# EAGLE design FET_1_0 (EAGLE 7.6.0)
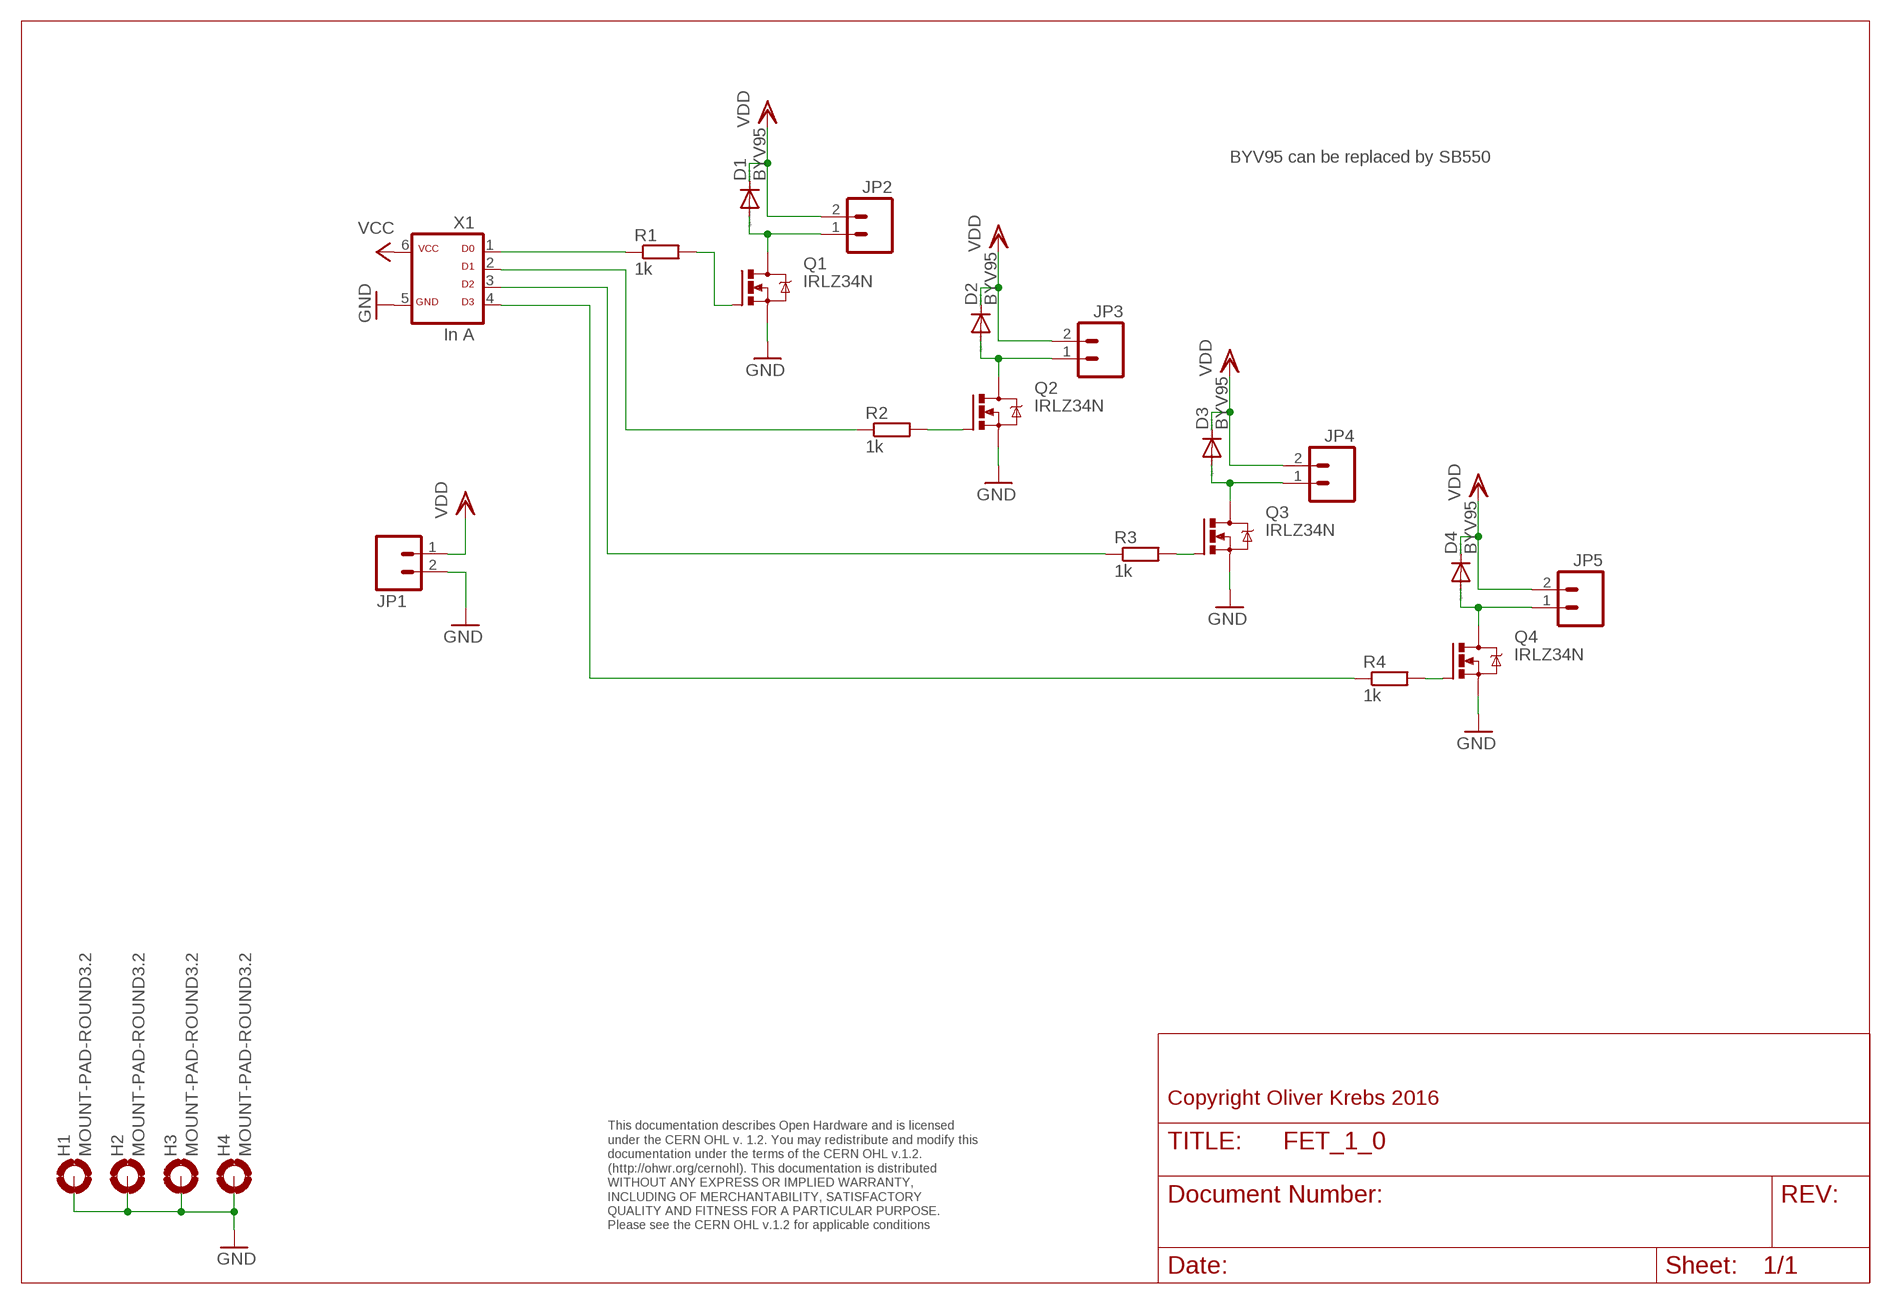
[diagram p0: schematic, sheet 1]

## Parts
D1  BYV95  [SOD57-10]
D2  BYV95  [SOD57-10]
D3  BYV95  [SOD57-10]
D4  BYV95  [SOD57-10]
H1  MOUNT-PAD-ROUND3.2  [3,2-PAD]
H2  MOUNT-PAD-ROUND3.2  [3,2-PAD]
H3  MOUNT-PAD-ROUND3.2  [3,2-PAD]
H4  MOUNT-PAD-ROUND3.2  [3,2-PAD]
JP1  M021.3MM-5.08  [1X02_BIG_5.08]
JP2  M021.3MM-5.08  [1X02_BIG_5.08]
JP3  M021.3MM-5.08  [1X02_BIG_5.08]
JP4  M021.3MM-5.08  [1X02_BIG_5.08]
JP5  M021.3MM-5.08  [1X02_BIG_5.08]
Q1  IRLZ34N  IRF530  [TO220BV]
Q2  IRLZ34N  IRF530  [TO220BV]
Q3  IRLZ34N  IRF530  [TO220BV]
Q4  IRLZ34N  IRF530  [TO220BV]
R1  1k  R-EU_0207/10  [0207/10]
R2  1k  R-EU_0207/10  [0207/10]
R3  1k  R-EU_0207/10  [0207/10]
R4  1k  R-EU_0207/10  [0207/10]
X1  In A  ML6D  [ML-6]

## Nets
GND: H1.B3,2(MOUNT) H2.B3,2(MOUNT) H3.B3,2(MOUNT) H4.B3,2(MOUNT) JP1.2 Q1.S Q2.S Q3.S Q4.S X1.5
N$1: Q1.G R1.2
N$2: Q2.G R2.2
N$3: D1.A JP2.1 Q1.D
N$4: Q3.G R3.2
N$5: Q4.G R4.2
N$6: D2.A JP3.1 Q2.D
N$9: D3.A JP4.1 Q3.D
N$12: D4.A JP5.1 Q4.D
N$13: R1.1 X1.1
N$14: R2.1 X1.2
N$15: R3.1 X1.3
N$16: R4.1 X1.4
VCC: X1.6
VDD: D1.C D2.C D3.C D4.C JP1.1 JP2.2 JP3.2 JP4.2 JP5.2

## Notes on the sheet
- BYV95 can be replaced by SB550
- Copyright Oliver Krebs 2016
- This documentation describes Open Hardware and is licensed 
  under the CERN OHL v. 1.2. You may redistribute and modify this 
  documentation under the terms of the CERN OHL v.1.2. 
  (http://ohwr.org/cernohl). This documentation is distributed
  WITHOUT ANY EXPRESS OR IMPLIED WARRANTY, 
  INCLUDING OF MERCHANTABILITY, SATISFACTORY 
  QUALITY AND FITNESS FOR A PARTICULAR PURPOSE. 
  Please see the CERN OHL v.1.2 for applicable conditions

## Library data of the parts
D1-D4 = diode:BYV95: DIODE fast soft-recovery controlled avalanche rectifier
H1-H4 = holes:MOUNT-PAD-ROUND: MOUNTING PAD, round
JP1-JP5 = SparkFun-Connectors:M02: Standard 2-pin 0.1" header. Use with - straight break away headers ( PRT-00116) - right angle break away headers (PRT-00553) - swiss pins (PRT-00743) - machine pins (PRT-00117) - female headers (PRT-00115) Molex polarized connector foot print use with: PRT-08233 with associated crimp pins and housings. 2.54_SCREWTERM for use with PRT-10571. 3.5mm Screw Terminal footprints for PRT-08084 5mm Screw Terminal footprints for use with PRT-08432
Q1-Q4 = transistor-power:IRF530: HEXFET Power MOSFET
R1-R4 = 01-my_rcl:R-EU_: RESISTOR, European symbol
X1 = 01-my-con:ML6D

## Board
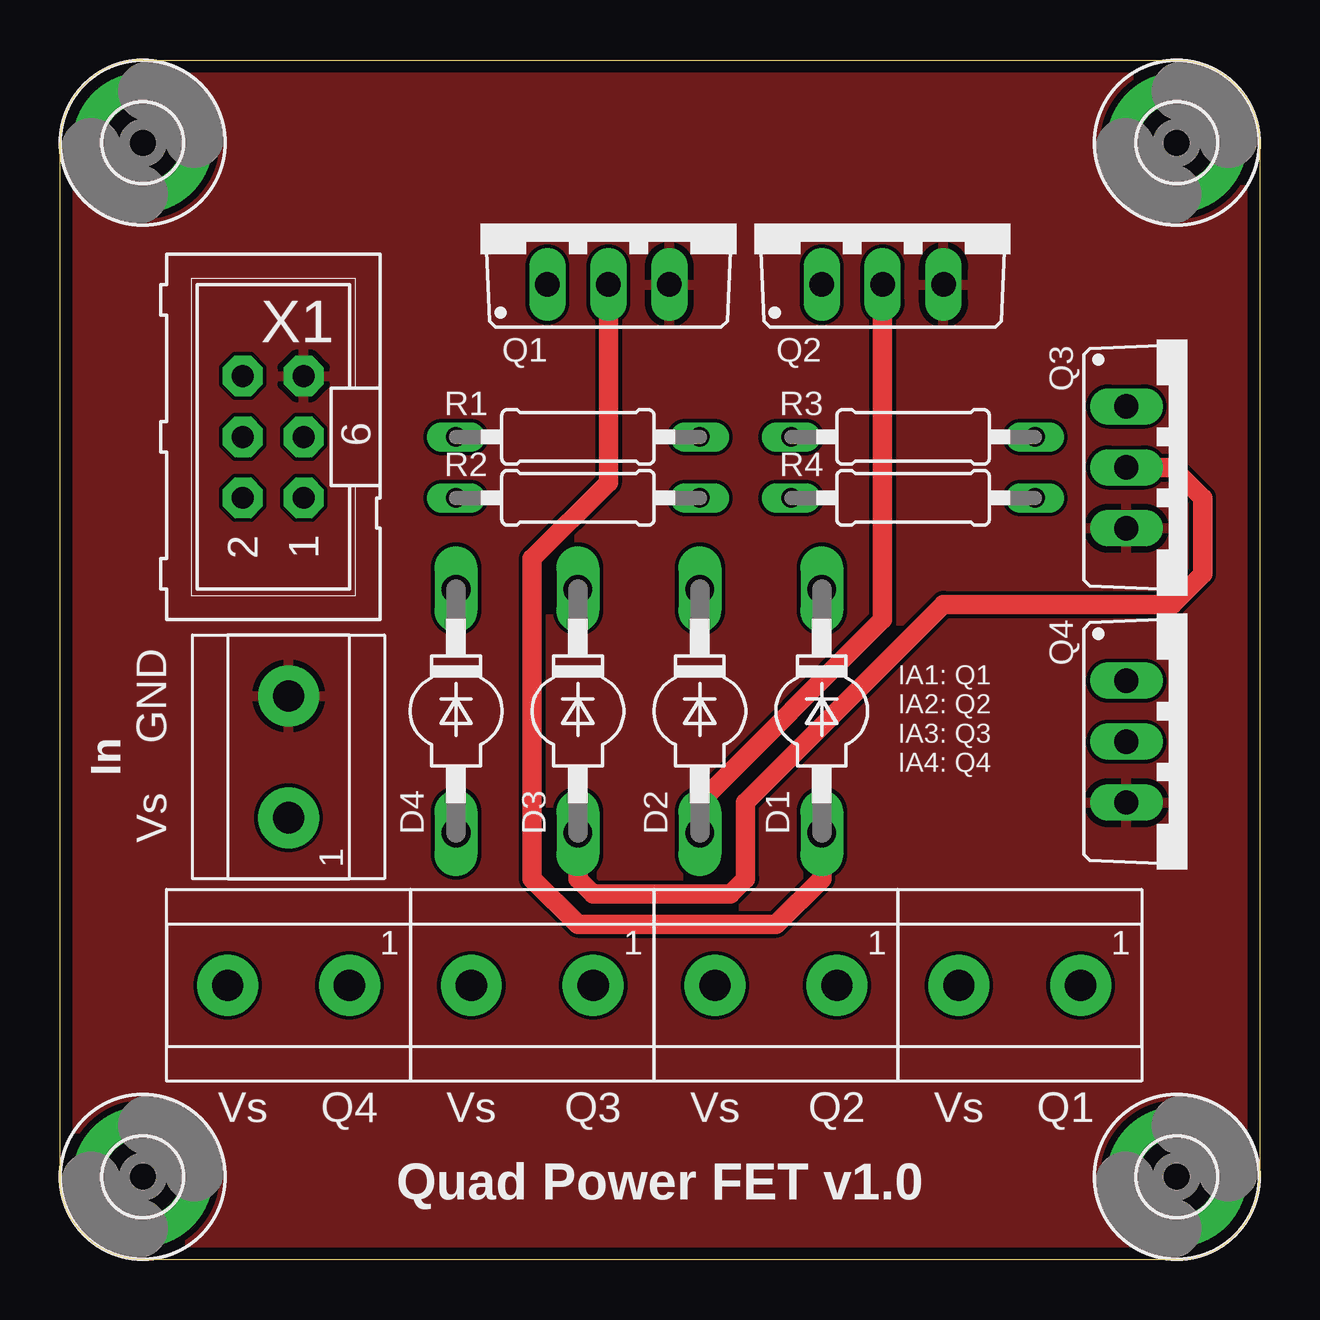
[diagram p1: board, top side]
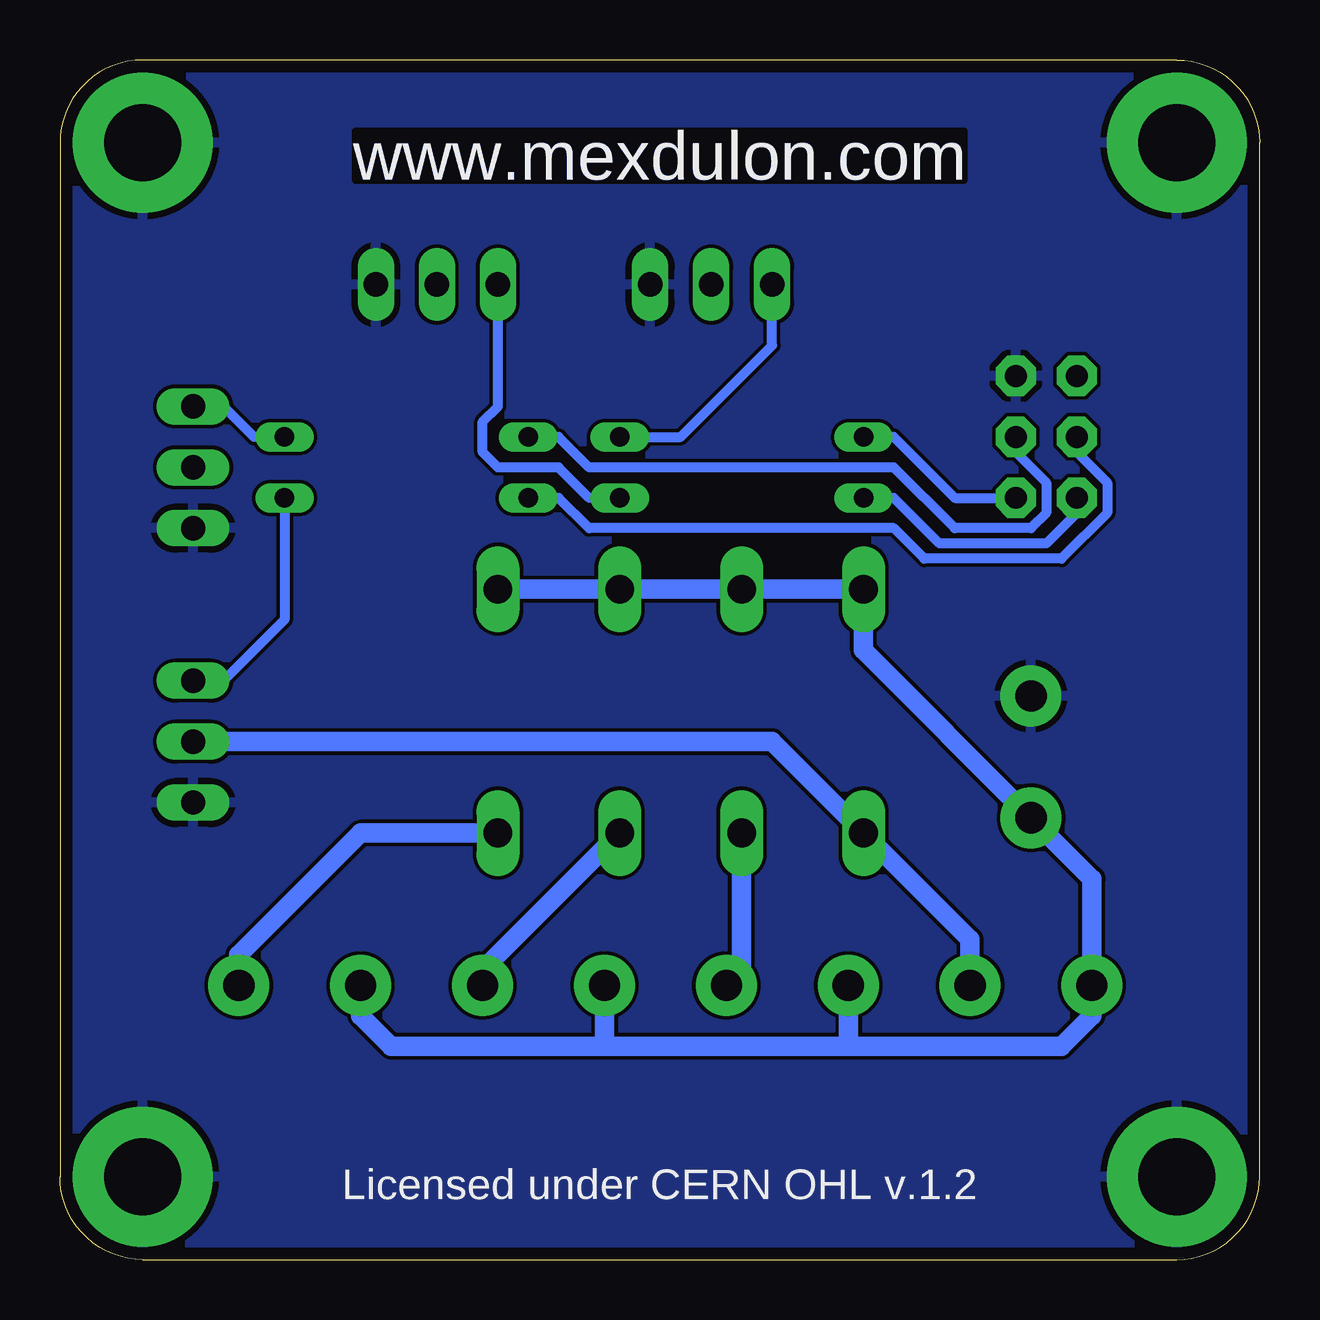
[diagram p2: board, bottom side, seen from below]

Size 50 x 50 mm. Coordinates in mm from the lower left corner, seen from the top.
Outline: 0,3.45 0,46.55 arc-90 3.45,50 46.55,50 arc-90 50,46.55 50,3.45 arc-90 46.55,0 3.45,0 arc-90 0,3.45
Copper layers (1*16): Top 0.035mm / dielectric 1.6mm / Bottom 0.035mm
Design rules "Elecrow_2-layer_PCB_eagle_rule": minimum track width 6mil, minimum drill 12mil, track to track 6mil, track to pad 6mil, pad to pad 6mil, via to via 8mil, smd to smd 0mil, copper to edge 20mil, drill to drill 10mil, minimum pad ring 6mil, minimum via ring 6mil, stop-mask expansion 0mil, vias tented up to drill 100mil, thermal gap 10mil

### Footprints (pad centres in the part's own frame; a part is rotated, then mirrored left to right if it is on the bottom)
SOD57-10 = drill 1.194 long: A 5.08,0; C -5.08,0
3,2-PAD = drill 3.2 pad 5.842: B3,2 0,0
1X02_BIG_5.08 = drill 1.3 pad 2.54: 1 -2.54,0; 2 2.54,0
TO220BV = drill 1.016 long: D 0,-2.54; G -2.54,-2.54; S 2.54,-2.54
0207/10 = drill 0.813 long: 1 -5.08,0; 2 5.08,0
ML-6 = drill 0.914 pad 1.676 octagon: 1 -2.54,-1.27; 2 -2.54,1.27; 3 0,-1.27; 4 0,1.27; 5 2.54,-1.27; 6 2.54,1.27

### Placement (x,y rotation side)
D1  31.75,22.86 270 top
D2  26.67,22.86 270 top
D3  21.59,22.86 270 top
D4  16.51,22.86 270 top
H1  3.45,3.45 0 top
H2  3.45,46.55 0 top
H3  46.55,3.45 0 top
H4  46.55,46.55 0 top
JP1  9.53,20.95 90 top
JP2  40.01,11.43 180 top
JP3  29.84,11.43 180 top
JP4  19.68,11.43 180 top
JP5  9.53,11.43 180 top
Q1  22.86,43.18 0 top
Q2  34.29,43.18 0 top
Q3  46.99,33.02 270 top
Q4  46.99,21.59 270 top
R1  21.59,34.29 0 top
R2  21.59,31.75 0 top
R3  35.56,34.29 0 top
R4  35.56,31.75 0 top
X1  8.89,34.29 90 top

### Tracks (layer width: path | path; a pad name or v marks a point on that pad's centre or on a via)
GND
  pour Bottom: -0.17,0 -0.17,50.16 50,50.16 50,0
  pour Top: -0.17,0 -0.17,50.16 50,50.16 50,0
N$1
  Bottom 0.406: R1.2 24.13,34.29 20.32,38.1 Q1.G
N$2
  Bottom 0.406: R2.2 27.94,31.75 29.21,33.02 31.75,33.02 32.38,33.66 32.38,34.92 31.75,35.56 Q2.G
N$3
  Top 0.813: Q1.D 22.86,32.38 19.68,29.21 19.68,15.88 21.59,13.97 29.84,13.97 31.75,15.88 D1.A
  Bottom 0.813: D1.A 37.47,17.78 42.55,12.7 JP2.1
N$4
  Bottom 0.406: R3.2 41.91,34.29 43.18,35.56 Q3.G
N$5
  Bottom 0.406: R4.2 40.64,26.67 43.18,24.13 Q4.G
N$6
  Top 0.813: Q2.D 34.29,26.67 26.67,19.05 D2.A
  Bottom 0.813: D2.A 32.38,12.06 JP3.1
N$9
  Top 0.813: D3.A 21.59,15.88 22.23,15.24 27.94,15.24 28.57,15.88 28.57,19.05 36.83,27.3 46.35,27.3 47.62,28.57 47.62,31.75 46.35,33.02 Q3.D
  Bottom 0.813: JP4.1 21.59,12.06 D3.A
N$12
  Bottom 0.813: JP5.1 12.06,13.34 D4.A 20.32,21.59 Q4.D
N$13
  Bottom 0.406: R1.1 15.24,34.29 12.7,31.75 X1.1
N$14
  Bottom 0.406: R2.1 15.24,31.75 13.34,29.84 8.89,29.84 7.62,31.11 X1.2
N$15
  Bottom 0.406: X1.3 10.16,33.66 8.89,32.38 8.89,31.11 9.53,30.48 12.7,30.48 15.24,33.02 27.94,33.02 29.21,34.29 R3.1
N$16
  Bottom 0.406: X1.4 7.62,33.66 6.35,32.38 6.35,31.11 8.26,29.21 13.97,29.21 15.24,30.48 27.94,30.48 29.21,31.75 R4.1
VDD
  Bottom 0.813: 17.14,8.89 8.26,8.89 6.99,10.16 JP5.2 6.99,15.88 JP1.1 16.51,25.4 D4.C D3.C D2.C D1.C | 17.14,8.89 27.3,8.89 | 27.3,8.89 36.2,8.89 37.47,10.16 JP2.2 | JP4.2 17.14,8.89 | JP3.2 27.3,8.89

### Text on the board
Bottom: www.mexdulon.com
tNames: GND | In | IA1: Q1 / IA2: Q2 / IA3: Q3 / IA4: Q4 | Vs | Vs | Q4 | Vs | Q3 | Vs | Q2 | Vs | Q1 | Quad Power FET v1.0
bNames: www.mexdulon.com | Licensed under CERN OHL v.1.2
200bmp: E:/Bilder/Elektronik/Modulion/Mexdulon/mexdulon_50x50_pcb.bmp